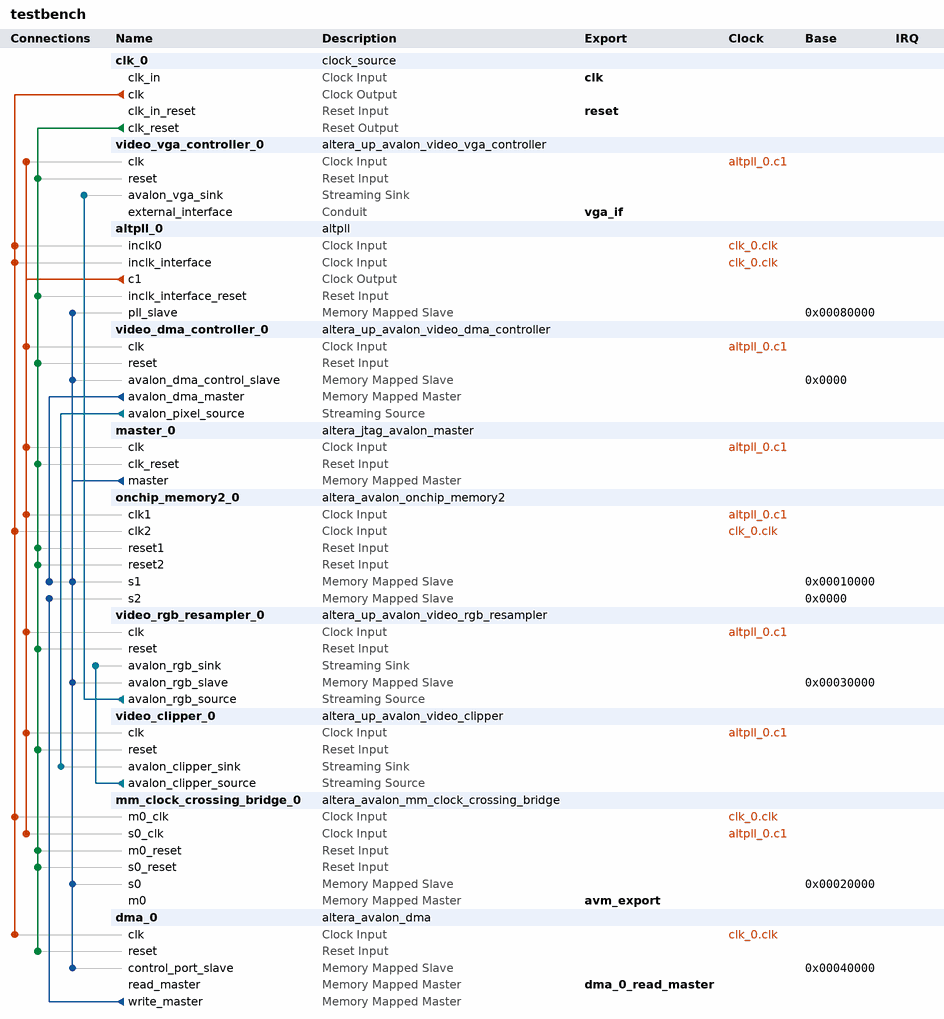
[diagram p0: system contents]
# Platform Designer (Qsys) system testbench, MAX 10 10M50DAF484C6GES
# Parameters at their usual value, and those the tool derives, are not listed.
package require -exact qsys 18.1
create_system testbench
set_project_property DEVICE_FAMILY {MAX 10}
set_project_property DEVICE 10M50DAF484C6GES

add_instance clk_0 clock_source 18.1
set_instance_parameter_value clk_0 clockFrequency 50000000
set_instance_parameter_value clk_0 resetSynchronousEdges DEASSERT

add_instance video_vga_controller_0 altera_up_avalon_video_vga_controller 18.0
set_instance_parameter_value video_vga_controller_0 board DE10-Lite
set_instance_parameter_value video_vga_controller_0 resolution {VGA 640x480}

add_instance altpll_0 altpll 18.1
set_instance_parameter_value altpll_0 AVALON_USE_SEPARATE_SYSCLK YES
set_instance_parameter_value altpll_0 CLK0_DIVIDE_BY 1
set_instance_parameter_value altpll_0 CLK0_MULTIPLY_BY 2
set_instance_parameter_value altpll_0 CLK1_DIVIDE_BY 2
set_instance_parameter_value altpll_0 CLK1_DUTY_CYCLE 50
set_instance_parameter_value altpll_0 CLK1_MULTIPLY_BY 1
set_instance_parameter_value altpll_0 CLK1_PHASE_SHIFT 0
set_instance_parameter_value altpll_0 INCLK0_INPUT_FREQUENCY 20000
set_instance_parameter_value altpll_0 PORT_ARESET PORT_UNUSED
set_instance_parameter_value altpll_0 PORT_LOCKED PORT_UNUSED
set_instance_parameter_value altpll_0 PORT_clk1 PORT_USED
set_instance_parameter_value altpll_0 PORT_clk2 PORT_UNUSED
set_instance_parameter_value altpll_0 PORT_clk3 PORT_UNUSED

add_instance video_dma_controller_0 altera_up_avalon_video_dma_controller 18.0
set_instance_parameter_value video_dma_controller_0 addr_mode Consecutive
set_instance_parameter_value video_dma_controller_0 back_start_address 0
set_instance_parameter_value video_dma_controller_0 color_bits 8
set_instance_parameter_value video_dma_controller_0 color_planes 1
set_instance_parameter_value video_dma_controller_0 dma_enabled true
set_instance_parameter_value video_dma_controller_0 height 32
set_instance_parameter_value video_dma_controller_0 mode {From Memory to Stream}
set_instance_parameter_value video_dma_controller_0 start_address 0
set_instance_parameter_value video_dma_controller_0 width 32

add_instance master_0 altera_jtag_avalon_master 18.1

add_instance onchip_memory2_0 altera_avalon_onchip_memory2 18.1
set_instance_parameter_value onchip_memory2_0 dataWidth 8
set_instance_parameter_value onchip_memory2_0 dualPort true
set_instance_parameter_value onchip_memory2_0 initMemContent true
set_instance_parameter_value onchip_memory2_0 initializationFileName C:/Users/alinn/OneDrive/Documents/GitHub/unl-mnist-scnn/tools/image.hex
set_instance_parameter_value onchip_memory2_0 instanceID IMG
set_instance_parameter_value onchip_memory2_0 memorySize 1024
set_instance_parameter_value onchip_memory2_0 resetrequest_enabled false
set_instance_parameter_value onchip_memory2_0 slave1Latency 2
set_instance_parameter_value onchip_memory2_0 slave2Latency 2
set_instance_parameter_value onchip_memory2_0 useNonDefaultInitFile true

add_instance video_rgb_resampler_0 altera_up_avalon_video_rgb_resampler 18.0
set_instance_parameter_value video_rgb_resampler_0 alpha 7
set_instance_parameter_value video_rgb_resampler_0 input_type {8-bit Grayscale}
set_instance_parameter_value video_rgb_resampler_0 output_type {30-bit RGB}

add_instance video_clipper_0 altera_up_avalon_video_clipper 18.0
set_instance_parameter_value video_clipper_0 add_bottom 440
set_instance_parameter_value video_clipper_0 add_left 8
set_instance_parameter_value video_clipper_0 add_right 600
set_instance_parameter_value video_clipper_0 add_top 8
set_instance_parameter_value video_clipper_0 color_bits 8
set_instance_parameter_value video_clipper_0 color_planes 1
set_instance_parameter_value video_clipper_0 drop_bottom 0
set_instance_parameter_value video_clipper_0 drop_left 0
set_instance_parameter_value video_clipper_0 drop_right 0
set_instance_parameter_value video_clipper_0 drop_top 0
set_instance_parameter_value video_clipper_0 height_in 32
set_instance_parameter_value video_clipper_0 width_in 32

add_instance mm_clock_crossing_bridge_0 altera_avalon_mm_clock_crossing_bridge 18.1
set_instance_parameter_value mm_clock_crossing_bridge_0 ADDRESS_WIDTH 10
set_instance_parameter_value mm_clock_crossing_bridge_0 COMMAND_FIFO_DEPTH 4
set_instance_parameter_value mm_clock_crossing_bridge_0 DATA_WIDTH 8
set_instance_parameter_value mm_clock_crossing_bridge_0 MASTER_SYNC_DEPTH 3
set_instance_parameter_value mm_clock_crossing_bridge_0 MAX_BURST_SIZE 1
set_instance_parameter_value mm_clock_crossing_bridge_0 RESPONSE_FIFO_DEPTH 4
set_instance_parameter_value mm_clock_crossing_bridge_0 SLAVE_SYNC_DEPTH 3
set_instance_parameter_value mm_clock_crossing_bridge_0 USE_AUTO_ADDRESS_WIDTH 1

add_instance dma_0 altera_avalon_dma 18.1
set_instance_parameter_value dma_0 allowByteTransactions true
set_instance_parameter_value dma_0 allowDoubleWordTransactions false
set_instance_parameter_value dma_0 allowHalfWordTransactions false
set_instance_parameter_value dma_0 allowQuadWordTransactions false
set_instance_parameter_value dma_0 allowWordTransactions false
set_instance_parameter_value dma_0 burstEnable false
set_instance_parameter_value dma_0 fifoDepth 4
set_instance_parameter_value dma_0 maxBurstSize 128
set_instance_parameter_value dma_0 minimumDmaTransactionRegisterWidth 11
set_instance_parameter_value dma_0 useRegistersForFIFO true

# connections
add_connection altpll_0.c1 master_0.clk clock
add_connection altpll_0.c1 mm_clock_crossing_bridge_0.s0_clk clock
add_connection altpll_0.c1 onchip_memory2_0.clk1 clock
add_connection altpll_0.c1 video_clipper_0.clk clock
add_connection altpll_0.c1 video_dma_controller_0.clk clock
add_connection altpll_0.c1 video_rgb_resampler_0.clk clock
add_connection altpll_0.c1 video_vga_controller_0.clk clock
add_connection clk_0.clk altpll_0.inclk0 clock
add_connection clk_0.clk altpll_0.inclk_interface clock
add_connection clk_0.clk dma_0.clk clock
add_connection clk_0.clk mm_clock_crossing_bridge_0.m0_clk clock
add_connection clk_0.clk onchip_memory2_0.clk2 clock
add_connection clk_0.clk_reset altpll_0.inclk_interface_reset reset
add_connection clk_0.clk_reset dma_0.reset reset
add_connection clk_0.clk_reset master_0.clk_reset reset
add_connection clk_0.clk_reset mm_clock_crossing_bridge_0.m0_reset reset
add_connection clk_0.clk_reset mm_clock_crossing_bridge_0.s0_reset reset
add_connection clk_0.clk_reset onchip_memory2_0.reset1 reset
add_connection clk_0.clk_reset onchip_memory2_0.reset2 reset
add_connection clk_0.clk_reset video_clipper_0.reset reset
add_connection clk_0.clk_reset video_dma_controller_0.reset reset
add_connection clk_0.clk_reset video_rgb_resampler_0.reset reset
add_connection clk_0.clk_reset video_vga_controller_0.reset reset
add_connection dma_0.write_master onchip_memory2_0.s2 avalon
set_connection_parameter_value dma_0.write_master/onchip_memory2_0.s2 baseAddress 0x0000
add_connection master_0.master altpll_0.pll_slave avalon
set_connection_parameter_value master_0.master/altpll_0.pll_slave baseAddress 0x00080000
add_connection master_0.master dma_0.control_port_slave avalon
set_connection_parameter_value master_0.master/dma_0.control_port_slave baseAddress 0x00040000
add_connection master_0.master mm_clock_crossing_bridge_0.s0 avalon
set_connection_parameter_value master_0.master/mm_clock_crossing_bridge_0.s0 baseAddress 0x00020000
add_connection master_0.master onchip_memory2_0.s1 avalon
set_connection_parameter_value master_0.master/onchip_memory2_0.s1 baseAddress 0x00010000
add_connection master_0.master video_dma_controller_0.avalon_dma_control_slave avalon
set_connection_parameter_value master_0.master/video_dma_controller_0.avalon_dma_control_slave baseAddress 0x0000
add_connection master_0.master video_rgb_resampler_0.avalon_rgb_slave avalon
set_connection_parameter_value master_0.master/video_rgb_resampler_0.avalon_rgb_slave baseAddress 0x00030000
add_connection video_dma_controller_0.avalon_dma_master onchip_memory2_0.s1 avalon
set_connection_parameter_value video_dma_controller_0.avalon_dma_master/onchip_memory2_0.s1 baseAddress 0x00010000
add_connection video_clipper_0.avalon_clipper_source video_rgb_resampler_0.avalon_rgb_sink avalon_streaming
add_connection video_dma_controller_0.avalon_pixel_source video_clipper_0.avalon_clipper_sink avalon_streaming
add_connection video_rgb_resampler_0.avalon_rgb_source video_vga_controller_0.avalon_vga_sink avalon_streaming

# exported interfaces
add_interface avm_export avalon master
set_interface_property avm_export EXPORT_OF mm_clock_crossing_bridge_0.m0
add_interface clk clock sink
set_interface_property clk EXPORT_OF clk_0.clk_in
add_interface dma_0_read_master avalon master
set_interface_property dma_0_read_master EXPORT_OF dma_0.read_master
add_interface reset reset sink
set_interface_property reset EXPORT_OF clk_0.clk_in_reset
add_interface vga_if conduit end
set_interface_property vga_if EXPORT_OF video_vga_controller_0.external_interface

set_interconnect_requirement {$system} qsys_mm.clockCrossingAdapter HANDSHAKE
set_interconnect_requirement {$system} qsys_mm.enableEccProtection FALSE
set_interconnect_requirement {$system} qsys_mm.insertDefaultSlave FALSE
set_interconnect_requirement {$system} qsys_mm.maxAdditionalLatency 1

save_system testbench.qsys
